# EAGLE design Level Shifter (EAGLE 6.2)
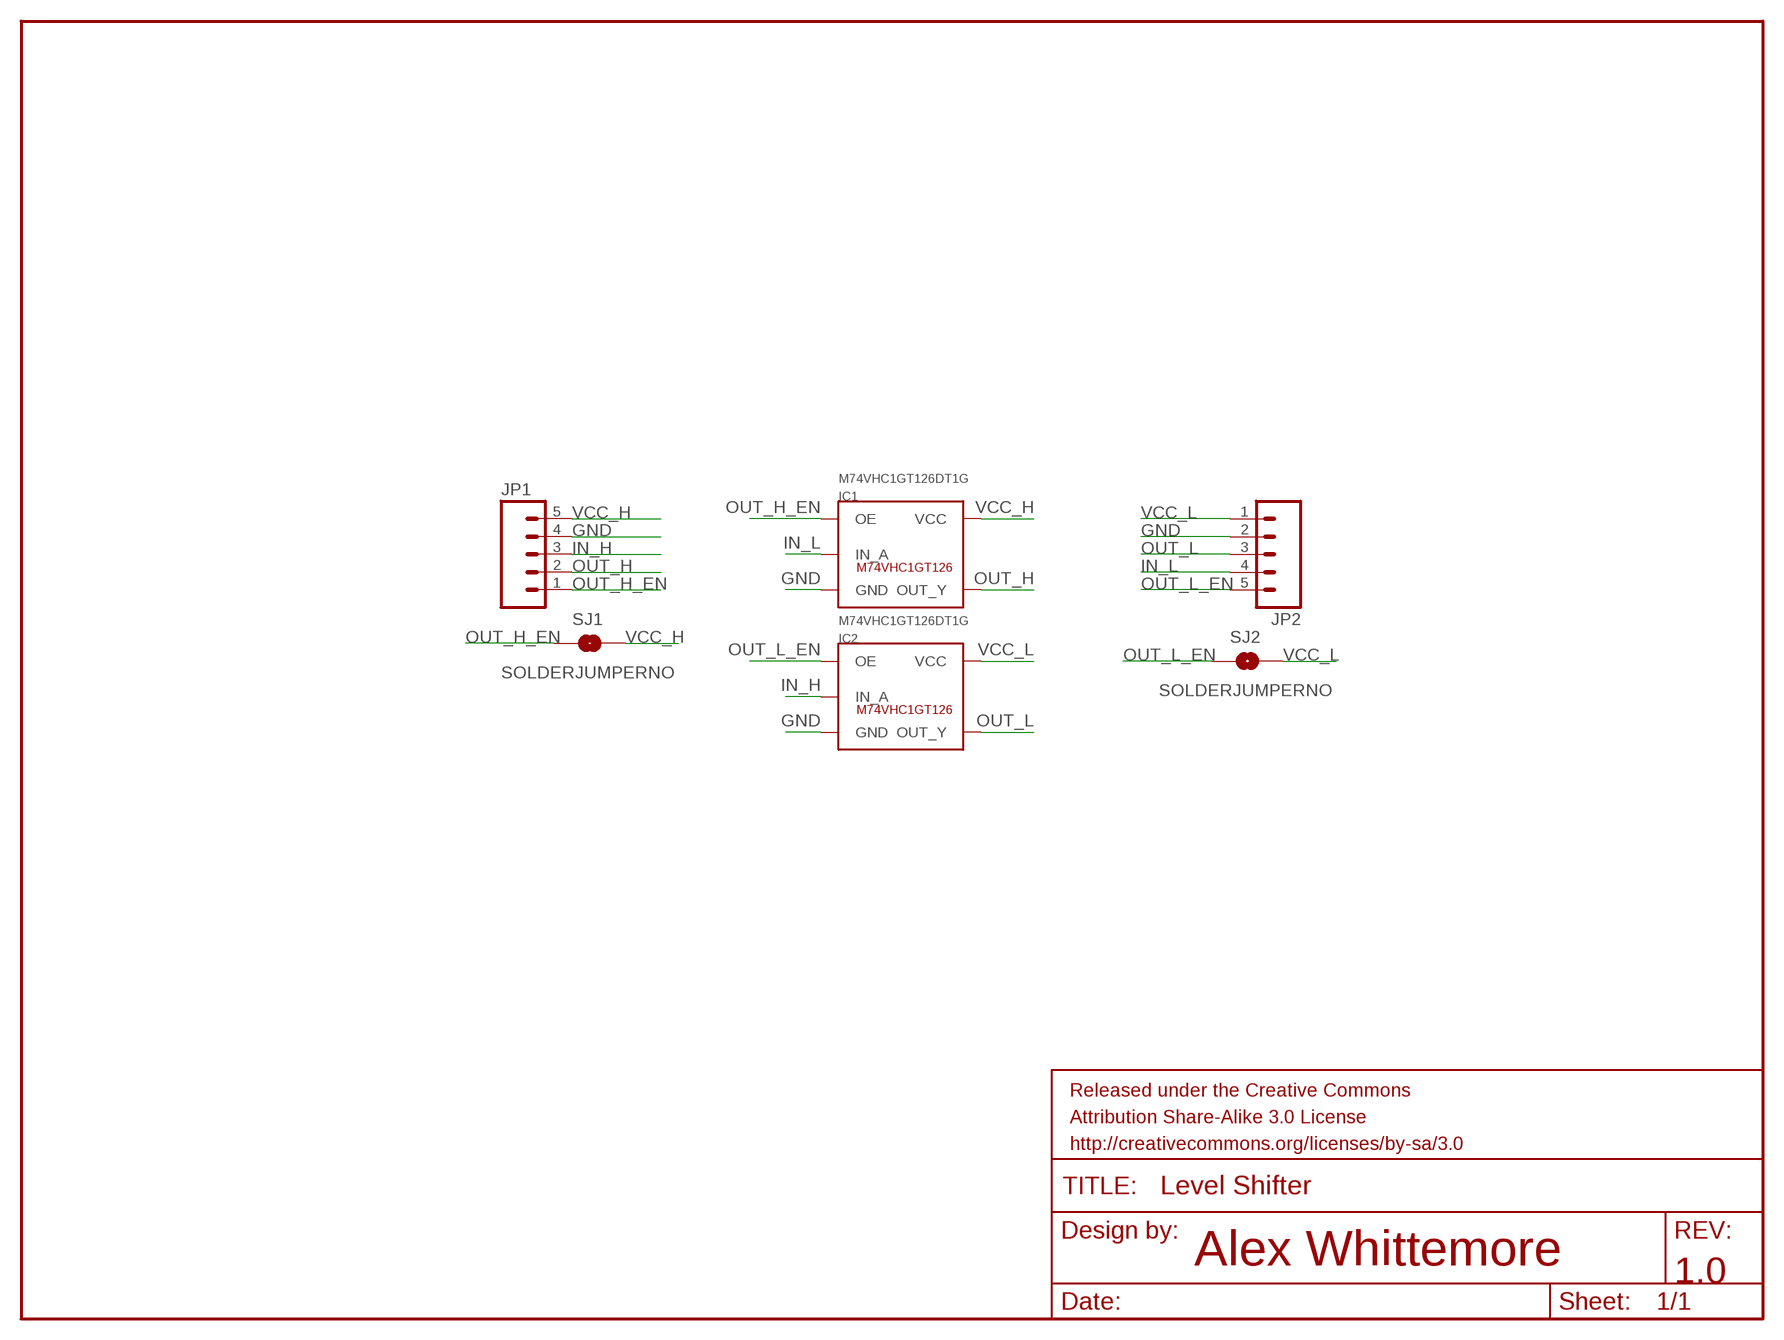
[diagram p0: schematic, sheet 1]

## Parts
IC1  M74VHC1GT126DT1G  [SOT23-5L]
IC2  M74VHC1GT126DT1G  [SOT23-5L]
JP1  M05LOCK  [1X05_LOCK]
JP2  M05LOCK  [1X05_LOCK]
SJ1  SOLDERJUMPERNO  [SJ_2S-NO]
SJ2  SOLDERJUMPERNO  [SJ_2S-NO]

## Nets
GND: IC1.3(GND) IC2.3(GND) JP1.4 JP2.2
IN_H: IC2.2(IN_A) JP1.3
IN_L: IC1.2(IN_A) JP2.4
OUT_H: IC1.4(OUT_Y) JP1.2
OUT_H_EN: IC1.1(OE) JP1.1 SJ1.1
OUT_L: IC2.4(OUT_Y) JP2.3
OUT_L_EN: IC2.1(OE) JP2.5 SJ2.1
VCC_H: IC1.5(VCC) JP1.5 SJ1.2
VCC_L: IC2.5(VCC) JP2.1 SJ2.2

## Notes on the sheet
- Alex Whittemore
- 1.0

## Library data of the parts
IC1 IC2 = AlexW-Eagle-Libraries:M74VHC1GT126
JP1 JP2 = SparkFun-Connectors:M05: Header 5 Standard 5-pin 0.1" header. Use with straight break away headers (SKU : PRT-00116), right angle break away headers (PRT-00553), swiss pins (PRT-00743), machine pins (PRT-00117), and female headers (PRT-00115). Molex polarized connector foot print use with SKU : PRT-08230 with associated crimp pins and housings.
SJ1 SJ2 = BUBB-Eagle-Library:SOLDERJUMPER: Solder Jumper Standard SMD solder jumper. Used to automate production. Two varients : Normally Open and Normally Closed are the same, but have different paste layers. NC will have a large amount of paste and should jumper during reflow.

## Board
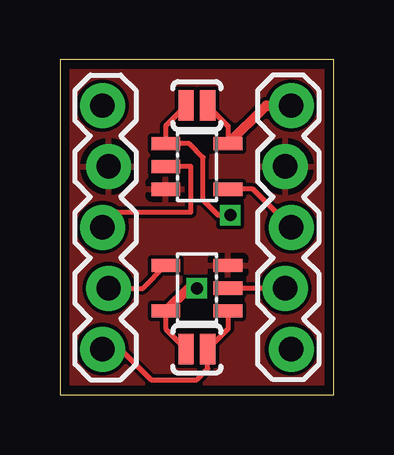
[diagram p1: board, top side]
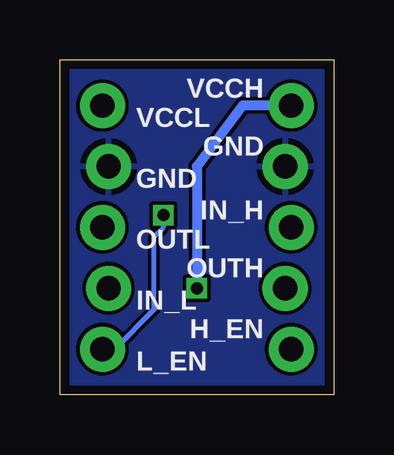
[diagram p2: board, bottom side, seen from below]

Size 11.43 x 13.97 mm. Coordinates in mm from the lower left corner, seen from the top.
Outline: 0,0 11.43,0 11.43,13.97 0,13.97 0,0
Copper layers (1*16): Top 0.0356mm / dielectric 1.5011mm / Bottom 0.0356mm
Design rules: minimum track width 6mil, minimum drill 13mil, track to track 6mil, track to pad 6mil, pad to pad 6mil, via to via 6mil, smd to smd 6mil, copper to edge 15mil, drill to drill 6mil, minimum pad ring 7mil, minimum via ring 7mil, stop-mask expansion 4mil, vias tented up to drill 0mil, thermal gap 10mil

### Footprints (pad centres in the part's own frame; a part is rotated, then mirrored left to right if it is on the bottom)
SOT23-5L = smd 0.55 x 1.2: 1 -0.95,-1.3; 2 0,-1.3; 3 0.95,-1.3; 4 0.95,1.3; 5 -0.95,1.3
1X05_LOCK = drill 1.016 pad 1.88: 1 0,0.127; 2 2.54,-0.127; 3 5.08,0.127; 4 7.62,-0.127; 5 10.16,0.127
SJ_2S-NO = smd 0.635 x 1.27: 1 -0.45,0; 2 0.45,0

### Placement (x,y rotation side)
IC1  5.71,4.45 90 top
IC2  5.71,9.53 270 top
JP1  1.91,1.91 90 top
JP2  9.53,12.06 270 top
SJ1  5.71,1.91 180 top
SJ2  5.71,12.06 0 top

### Tracks (layer width: path | path; a pad name or v marks a point on that pad's centre or on a via)
GND
  pour Top: 0,0 0,13.97 11.43,13.97 11.43,0
  pour Bottom: 0,13.97 11.43,13.97 11.43,0 0,0
IN_H
  Top 0.203: JP1.3 2.41,7.62 5.46,7.62 5.46,9.53 IC2.2
IN_L
  Top 0.203: JP2.4 IC1.2
OUT_H
  Top 0.203: JP1.2 3.46,4.45 IC1.4
OUT_H_EN
  Top 0.203: IC1.1 7.01,2.75 SJ1.1 6.17,1.08 5.71,0.64 3.81,0.64 2.54,1.91 JP1.1
OUT_L
  Top 0.203: JP2.3 8.06,8.57 IC2.4
OUT_L_EN  (via drill 0.5)
  Top 0.203: SJ2.1 4.42,11.21 IC2.1 5.4,10.47 5.97,9.91 5.97,8.13 6.6,7.49 v7.11,7.49 6.99,7.49
  Bottom 0.203: JP2.5 9.14,1.91 7.49,3.56 7.49,6.6 7.11,6.99 v7.11,7.49
VCC_H  (via drill 0.5)
  Top 0.203: IC1.5 4.42,2.75 SJ1.2
  Top 0.406: v5.71,4.45 5.37,4.45 IC1.5
  Bottom 0.406: JP1.5 3.81,12.06 5.71,9.53 v5.71,4.45
VCC_L
  Top 0.203: SJ2.2 7.01,11.21 IC2.5
  Top 0.406: IC2.5 8.61,12.06 JP2.1

### Text on the board
bPlace: VCCH | GND | VCCL | GND | IN_H | OUTH | OUTL | IN_L | H_EN | L_EN